# EAGLE design Arduino Nano2 (EAGLE 7.6.0)
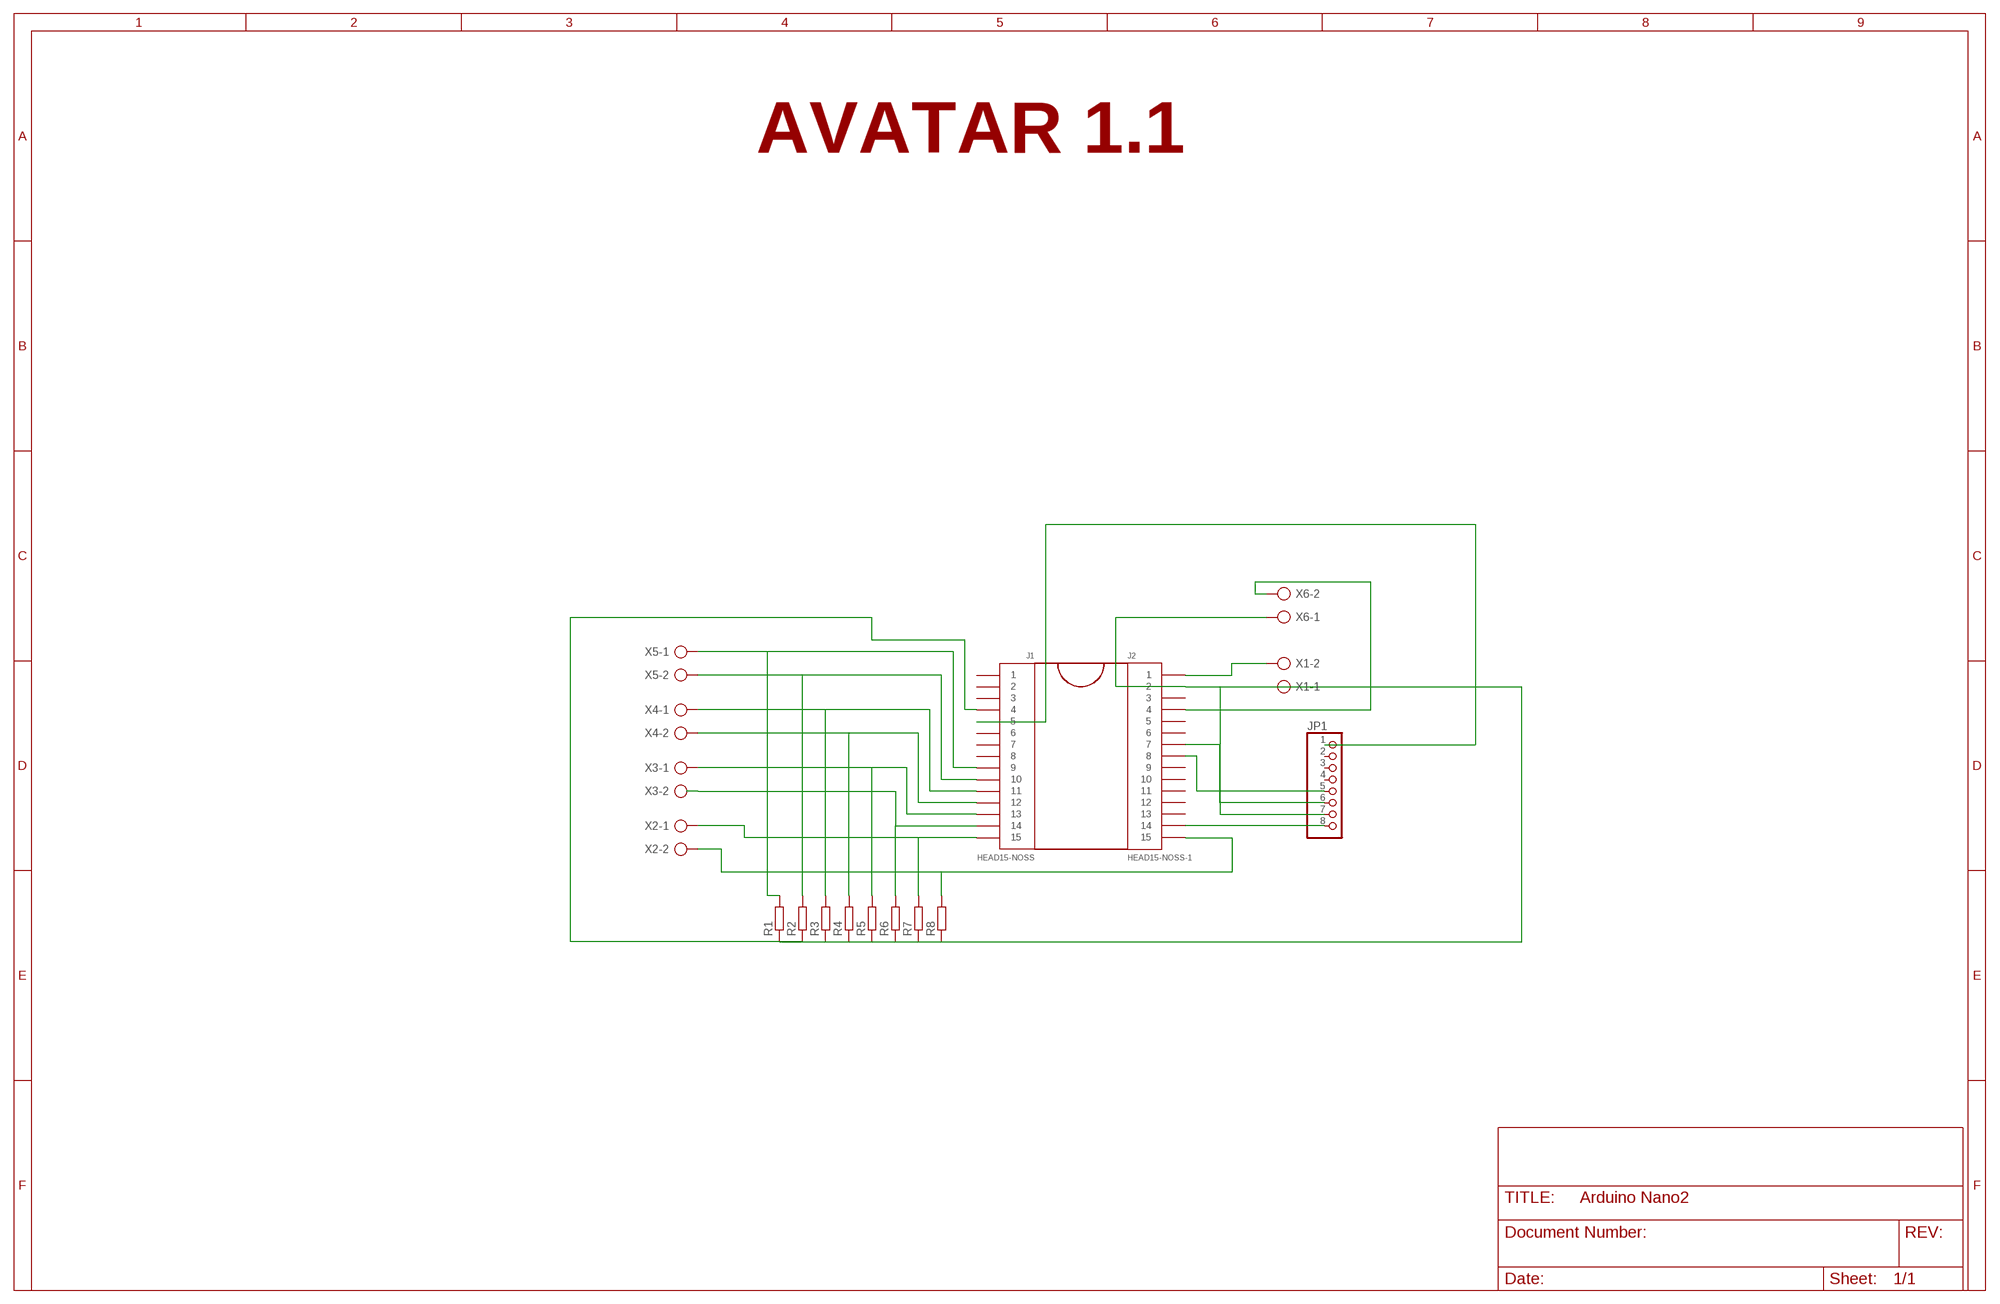
[diagram p0: schematic, sheet 1]

## Parts
J1  HEAD15-NOSS  [HEAD15-NOSS]
J2  HEAD15-NOSS-1  [HEAD15-NOSS-1]
JP1  PINHD-1X8  [1X08]
R1  R-EU_0204/7  [0204/7]
R2  R-EU_0204/7  [0204/7]
R3  R-EU_0204/7  [0204/7]
R4  R-EU_0204/7  [0204/7]
R5  R-EU_0204/7  [0204/7]
R6  R-EU_0204/7  [0204/7]
R7  R-EU_0204/7  [0204/7]
R8  R-EU_0204/7  [0204/7]
X1  AK500/2  [AK500/2]
X2  AK500/2  [AK500/2]
X3  AK500/2  [AK500/2]
X4  AK500/2  [AK500/2]
X5  AK500/2  [AK500/2]
X6  AK500/2  [AK500/2]

## Nets
N$1: J2.1 X1.2
N$2: J1.14 R6.2 X3.2
N$3: J2.15 R8.2 X2.2
N$4: J1.5 JP1.1
N$5: J1.15 R7.2 X2.1
N$7: J1.13 R5.2 X3.1
N$8: J1.12 R4.2 X4.2
N$9: J1.11 R3.2 X4.1
N$10: J1.10 R2.2 X5.2
N$11: J1.9 R1.2 X5.1
N$12: J1.4 J2.2 JP1.7 R1.1 R2.1 R3.1 R4.1 R5.1 R6.1 R7.1 R8.1 X1.1 X6.1
N$14: J2.14 JP1.8
N$15: J2.4 X6.2
N$16: J2.7 JP1.6
N$17: J2.8 JP1.5
Unconnected: J1.1 J1.2 J1.3 J1.6 J1.7 J1.8 J2.3 J2.5 J2.6 J2.9 J2.10 J2.11 J2.12 J2.13 JP1.2 JP1.3 JP1.4

## Notes on the sheet
- AVATAR 1.1

## Library data of the parts
J1 = MyCON2:HEAD15-NOSS
J2 = MyCON2:HEAD15-NOSS-1
JP1 = pinhead:PINHD-1X8: PIN HEADER
R1-R8 = resistor:R-EU_: RESISTOR, European symbol
X1-X6 = con-ptr500:AK500/2: CONNECTOR; OC_FARNELL: unknown; OC_NEWARK: unknown

## Board
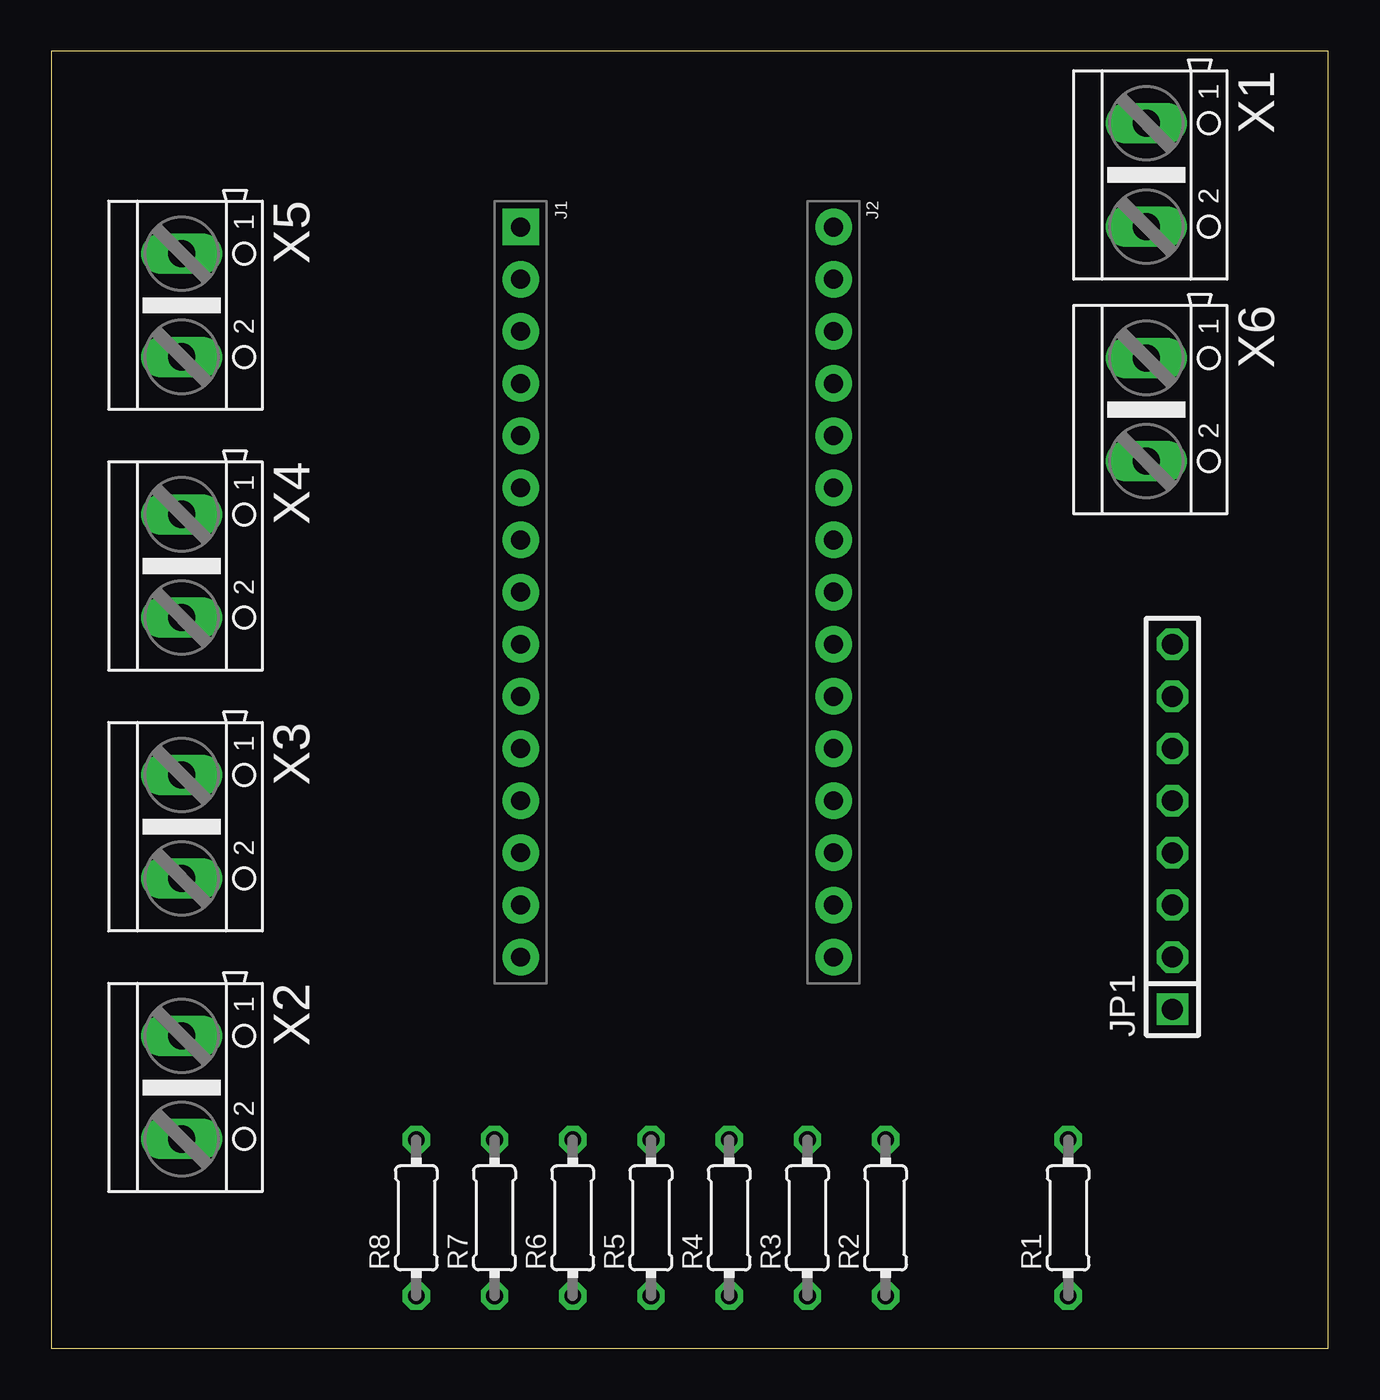
[diagram p1: board, top side]
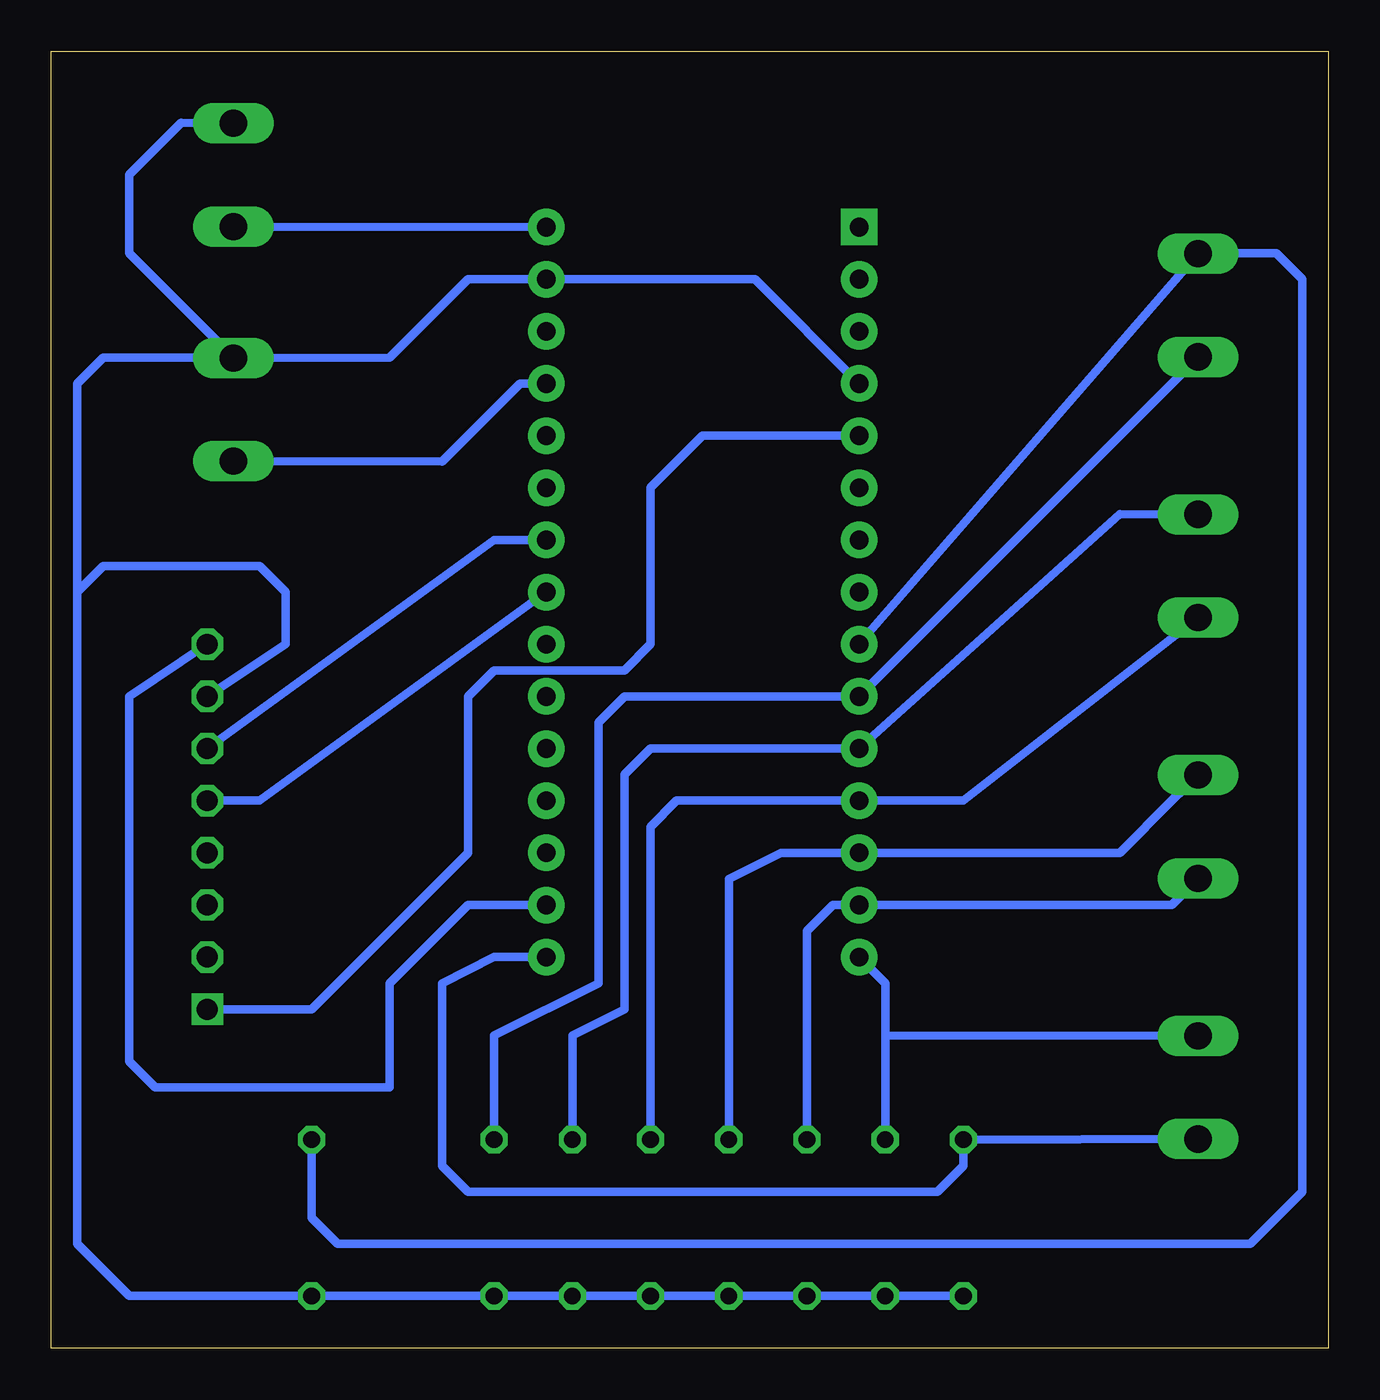
[diagram p2: board, bottom side, seen from below]

Size 62.21 x 63.17 mm. Coordinates in mm from the lower left corner, seen from the top.
Outline: 0,0 62.21,0 62.21,63.17 0,63.17 0,0
Copper layers (1*16): Top 0.035mm / dielectric 1.5mm / Bottom 0.035mm
Design rules "default": minimum track width 10mil, minimum drill 24mil, track to track 8mil, track to pad 8mil, pad to pad 8mil, via to via 8mil, smd to smd 8mil, copper to edge 40mil, drill to drill 8mil, minimum pad ring 10mil, minimum via ring 8mil, stop-mask expansion 4mil, vias tented up to drill 0mil, thermal gap 10mil

### Footprints (pad centres in the part's own frame; a part is rotated, then mirrored left to right if it is on the bottom)
HEAD15-NOSS = drill 0.914 pad 1.778 square: 1 0,0 | drill 0.914 pad 1.778: 2 2.54,0; 3 5.08,0; 4 7.62,0; 5 10.16,0; 6 12.7,0; 7 15.24,0; 8 17.78,0; 9 20.32,0; 10 22.86,0; 11 25.4,0; 12 27.94,0; 13 30.48,0; 14 33.02,0; 15 35.56,0
HEAD15-NOSS-1 = drill 0.914 pad 1.778: 1 0,0; 2 2.54,0; 3 5.08,0; 4 7.62,0; 5 10.16,0; 6 12.7,0; 7 15.24,0; 8 17.78,0; 9 20.32,0; 10 22.86,0; 11 25.4,0; 12 27.94,0; 13 30.48,0; 14 33.02,0; 15 35.56,0
1X08 = drill 1.016 square: 1 -8.89,0 | drill 1.016 octagon: 2 -6.35,0; 3 -3.81,0; 4 -1.27,0; 5 1.27,0; 6 3.81,0; 7 6.35,0; 8 8.89,0
0204/7 = drill 0.813 octagon: 1 -3.81,0; 2 3.81,0
AK500/2 = drill 1.321 long: 1 -2.515,0; 2 2.515,0

### Placement (x,y rotation side)
J1  22.86,54.61 270 top
J2  38.1,54.61 270 top
JP1  54.61,25.4 90 top
R1  49.53,6.35 90 top
R2  40.64,6.35 90 top
R3  36.83,6.35 90 top
R4  33.02,6.35 90 top
R5  29.21,6.35 90 top
R6  25.4,6.35 90 top
R7  21.59,6.35 90 top
R8  17.78,6.35 90 top
X1  53.34,57.15 270 top
X2  6.35,12.7 270 top
X3  6.35,25.4 270 top
X4  6.35,38.1 270 top
X5  6.35,50.8 270 top
X6  53.34,45.72 270 top

### Tracks (layer width: path | path; a pad name or v marks a point on that pad's centre or on a via)
N$1
  Bottom 0.406: J2.1 X1.2
N$2
  Bottom 0.406: R6.2 25.4,20.32 24.13,21.59 J1.14 7.62,21.59 X3.2
N$3
  Bottom 0.406: X2.2 R8.2 17.78,8.89 19.05,7.62 41.91,7.62 43.18,8.89 43.18,17.78 40.64,19.05 J2.15
N$4
  Bottom 0.406: JP1.1 49.53,16.51 41.91,24.13 41.91,31.75 40.64,33.02 34.29,33.02 33.02,34.29 33.02,41.91 30.48,44.45 J1.5
N$5
  Bottom 0.406: R7.2 21.59,15.24 | 21.59,15.24 21.59,17.78 J1.15 | X2.1 21.59,15.24
N$7
  Bottom 0.406: R5.2 29.21,22.86 26.67,24.13 J1.13 10.16,24.13 7.62,26.67 X3.1
N$8
  Bottom 0.406: R4.2 33.02,25.4 31.75,26.67 J1.12 17.78,26.67 X4.2
N$9
  Bottom 0.406: R3.2 36.83,15.24 34.29,16.51 34.29,27.94 33.02,29.21 J1.11 10.16,40.64 X4.1
N$10
  Bottom 0.406: R2.2 40.64,15.24 35.56,17.78 35.56,30.48 34.29,31.75 J1.10 X5.2
N$11
  Bottom 0.406: X5.1 J1.9 6.35,53.34 2.54,53.34 1.27,52.07 1.27,7.62 3.81,5.08 48.26,5.08 49.53,6.35 R1.2
N$12
  Bottom 0.406: R8.1 R7.1 R6.1 R5.1 R4.1 R3.1 R2.1 R1.1 58.42,2.54 60.96,5.08 60.96,36.83 | J1.4 27.94,52.07 J2.2 41.91,52.07 45.72,48.26 X6.1 55.88,48.26 | 60.96,36.83 60.96,46.99 59.69,48.26 55.88,48.26 | JP1.7 50.8,34.29 50.8,36.83 52.07,38.1 59.69,38.1 60.96,36.83 | 55.88,48.26 53.34,48.26 58.42,53.34 58.42,57.15 55.88,59.69 X1.1
N$14
  Bottom 0.406: JP1.8 58.42,31.75 58.42,13.97 57.15,12.7 45.72,12.7 45.72,17.78 41.91,21.59 J2.14
N$15
  Bottom 0.406: X6.2 43.18,43.18 39.37,46.99 J2.4
N$16
  Bottom 0.406: JP1.6 40.64,39.37 J2.7
N$17
  Bottom 0.406: J2.8 52.07,26.67 JP1.5